# EAGLE design ESP8266 (EAGLE 7.0.0)
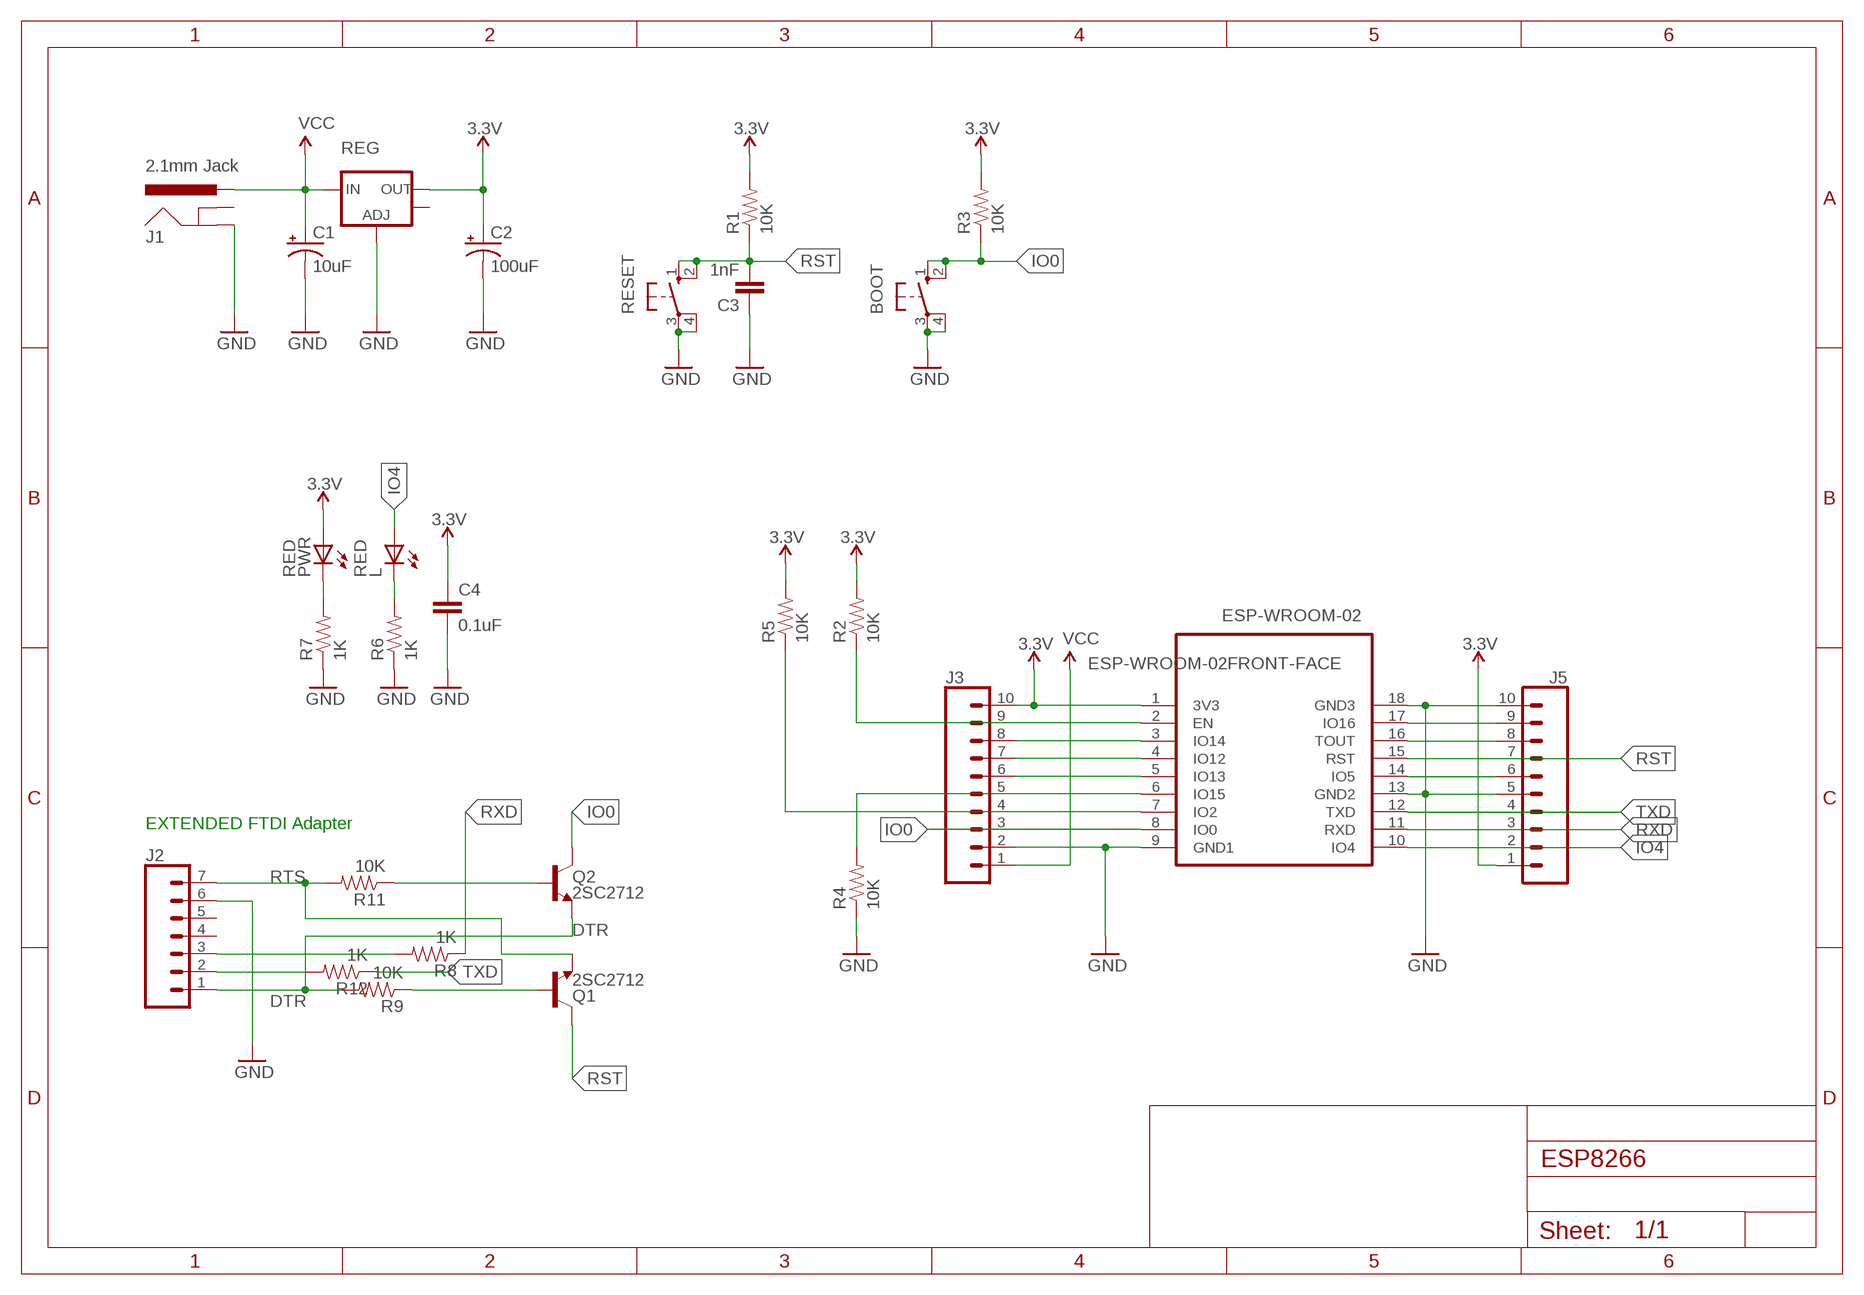
[diagram p0: schematic, sheet 1]

## Parts
BOOT  10-XX  [B3F-10XX]
C1  10uF  CAP_POLD  [PANASONIC_D]
C2  100uF  CAP_POLD  [PANASONIC_D]
C3  1nF  CAP0805  [0805]
C4  0.1uF  CAP0805  [0805]
ESP-WROOM-02  ESP-WROOM-02FRONT-FACE  [FRONT-FACE]
J1  2.1mm Jack  POWER_JACKPTH_LOCK  [POWER_JACK_PTH_LOCK]
J2  CONN_07LOCK  [1X07_LOCK]
J3  CONN_10"  [1X10]
J5  CONN_10"  [1X10]
L  RED  LEDCHIP-LED0805  [CHIP-LED0805]
PWR  RED  LEDCHIP-LED0805  [CHIP-LED0805]
Q1  2SC2712  TRANS_NPN-MMBTA42  [SOT23-3]
Q2  2SC2712  TRANS_NPN-MMBTA42  [SOT23-3]
R1  10K  RESISTOR0805-RES  [0805]
R2  10K  RESISTOR0805-RES  [0805]
R3  10K  RESISTOR0805-RES  [0805]
R4  10K  RESISTOR0805-RES  [0805]
R5  10K  RESISTOR0805-RES  [0805]
R6  1K  RESISTOR0805-RES  [0805]
R7  1K  RESISTOR0805-RES  [0805]
R8  1K  RESISTOR0805-RES  [0805]
R9  10K  RESISTOR0805-RES  [0805]
R11  10K  RESISTOR0805-RES  [0805]
R12  1K  RESISTOR0805-RES  [0805]
REG  V_REG_LM1117SOT223  [SOT223]
RESET  10-XX  [B3F-10XX]

## Nets
3.3V [PWR]: C2.+ C4.1 ESP-WROOM-02.1(3V3) J3.10 J5.1 PWR.A R1.2 R2.2 R3.2 R5.2 REG.2(OUT)
B: Q2.1(B) R11.1
DTR: J2.1 Q2.2(E) R9.2
EN: ESP-WROOM-02.2(EN) J3.9 R2.1
GND [PWR]: BOOT.3(P) BOOT.4(P1) C1.- C2.- C3.1 C4.2 ESP-WROOM-02.9(GND1) ESP-WROOM-02.13(GND2) ESP-WROOM-02.18(GND3) J1.GND J2.6 J3.2 J5.5 J5.10 R4.1 R6.1 R7.1 REG.1(ADJ) RESET.3(P) RESET.4(P1)
IO0: BOOT.1(S) BOOT.2(S1) ESP-WROOM-02.8(IO0) J3.3 Q2.3(C) R3.1
IO4: ESP-WROOM-02.10(IO4) J5.2 L.A
N$1: J2.2 R12.2
N$2: J2.3 R8.2
N$3: Q1.1(B) R9.1
N$6: ESP-WROOM-02.3(IO14) J3.8
N$7: ESP-WROOM-02.4(IO12) J3.7
N$8: ESP-WROOM-02.5(IO13) J3.6
N$9: ESP-WROOM-02.6(IO15) J3.5 R4.2
N$10: ESP-WROOM-02.7(IO2) J3.4 R5.1
N$11 [PWR]: PWR.C R7.2
N$12 [PWR]: L.C R6.2
N$16: ESP-WROOM-02.17(IO16) J5.9
N$17: ESP-WROOM-02.16(TOUT) J5.8
N$19: ESP-WROOM-02.14(IO5) J5.6
RST: C3.2 ESP-WROOM-02.15(RST) J5.7 Q1.3(C) R1.1 RESET.1(S) RESET.2(S1)
RTS: J2.7 Q1.2(E) R11.2
RXD: ESP-WROOM-02.11(RXD) J5.3 R8.1
TXD: ESP-WROOM-02.12(TXD) J5.4 R12.1
VCC [PWR]: C1.+ J1.PWR J3.1 REG.3(IN)
Unconnected: J1.GNDBREAK J2.4 J2.5 REG.4(OUT)

## Notes on the sheet
- EXTENDED FTDI Adapter

## Library data of the parts
BOOT RESET = ginger:10-XX: OMRON SWITCH
C1 C2 = SparkFun:CAP_POL: Capacitor Polarized These are standard SMD and PTH capacitors. Normally 10uF, 47uF, and 100uF in electrolytic and tantalum varieties. Always verify the external diameter of the through hole cap, it varies with capacity, voltage, and manufacturer. The EIA devices should be standard.
C3 C4 = SparkFun:CAP: Capacitor Standard 0603 ceramic capacitor, and 0.1" leaded capacitor.
ESP-WROOM-02 = esp-wroom-02:ESP-WROOM-02: WiFi module - ESP-WROOM-02
J1 = SparkFun-Connectors:POWER_JACK: Power Jack This is the standard 5.5mm barrel jack for power. The PTH is the most common, proven, reliable, footprint. The Slot footprint only works if the mill layer is transmitted to the PCB fab house so be warned. Spark Fun Electronics SKU : PRT-00119 SMT: CONN-08106 Mating wall wart : TOL-00298 (and others)
J2 = SparkFun-Connectors:CONN_07: Multi connection point. Often used as Generic Header-pin footprint for 0.1 inch spaced/style header connections On any of the 0.1 inch spaced packages, you can populate with these: Break Away Headers - Straight <https://www.sparkfun.com/products/116> (PRT-00116) Break Away Male Headers - Right Angle <https://www.sparkfun.com/products/553> (PRT-00553) Female Headers <https://www.sparkfun.com/products/115> (PRT-00115) Break Away Headers - Machine Pin <https://www.sparkfun.com/products/117> (PRT-00117) Break Away Female Headers - Swiss Machine Pin <https://www.sparkfun.com/products/743> (PRT-00743) For SCREWTERMINALS and SPRING TERMINALS visit here: Screw Terimnals on SparkFun.com <https://www.sparkfun.com/search/results?term=Screw+Terminals> (5mm/3.5mm/2.54mm spacing) This device is also useful as a general connection point to wire up your design to another part of your project. Our various solder wires solder well into these plated through hole pads. Hook-Up Wire - Assortment (Stranded, 22 AWG) <https://www.sparkfun.com/products/11375> (PRT-11375) Hook-Up Wire - Assortment (Solid Core, 22 AWG) <https://www.sparkfun.com/products/11367> (PRT-11367) View the entire wire category on our website here <https://www.sparkfun.com/categories/141> Special notes: Molex polarized connector foot print use with SKU : PRT-08231 with associated crimp pins and housings. 1MM SMD Version SKU: PRT-10208 NOTES ON THE VARIANTS LOCK and LOCK_LONGPADS... This footprint was designed to help hold the alignment of a through-hole component (i.e. 6-pin header) while soldering it into place. You may notice that each hole has been shifted either up or down by 0.005 of an inch from it's more standard position (which is a perfectly straight line). This slight alteration caused the pins (the squares in the middle) to touch the edges of the holes. Because they are alternating, it causes a "brace" to hold the component in place. 0.005 has proven to be the perfect amount of "off-center" position when using our standard breakaway headers. Although looks a little odd when you look at the bare footprint, once you have a header in there, the alteration is very hard to notice. Also,if you push a header all the way into place, it is covered up entirely on the bottom side.
J3 J5 = SparkFun-Connectors:CONN_10: Multi connection point. Often used as Generic Header-pin footprint for 0.1 inch spaced/style header connections On any of the 0.1 inch spaced packages, you can populate with these: Break Away Headers - Straight <https://www.sparkfun.com/products/116> (PRT-00116) Break Away Male Headers - Right Angle <https://www.sparkfun.com/products/553> (PRT-00553) Female Headers <https://www.sparkfun.com/products/115> (PRT-00115) Break Away Headers - Machine Pin <https://www.sparkfun.com/products/117> (PRT-00117) Break Away Female Headers - Swiss Machine Pin <https://www.sparkfun.com/products/743> (PRT-00743) Arduino Stackable Header - 10 Pin <https://www.sparkfun.com/products/11376> (PRT-11376) For SCREWTERMINALS and SPRING TERMINALS visit here: Screw Terimnals on SparkFun.com <https://www.sparkfun.com/search/results?term=Screw+Terminals> (5mm/3.5mm/2.54mm spacing) This device is also useful as a general connection point to wire up your design to another part of your project. Our various solder wires solder well into these plated through hole pads. Hook-Up Wire - Assortment (Stranded, 22 AWG) <https://www.sparkfun.com/products/11375> (PRT-11375) Hook-Up Wire - Assortment (Solid Core, 22 AWG) <https://www.sparkfun.com/products/11367> (PRT-11367) View the entire wire category on our website here <https://www.sparkfun.com/categories/141> Special notes: Molex polarized connector foot print use with SKU : PRT-08231 with associated crimp pins and housings. 1MM SMD Version SKU: PRT-10208 NOTES ON THE VARIANTS LOCK and LOCK_LONGPADS... This footprint was designed to help hold the alignment of a through-hole component (i.e. 6-pin header) while soldering it into place. You may notice that each hole has been shifted either up or down by 0.005 of an inch from it's more standard position (which is a perfectly straight line). This slight alteration caused the pins (the squares in the middle) to touch the edges of the holes. Because they are alternating, it causes a "brace" to hold the component in place. 0.005 has proven to be the perfect amount of "off-center" position when using our standard breakaway headers. Although looks a little odd when you look at the bare footprint, once you have a header in there, the alteration is very hard to notice. Also,if you push a header all the way into place, it is covered up entirely on the bottom side.; PROD_ID: CONN-11563
L PWR = adafruit:LED: LED OSRAM: - CHIPLED LG R971, LG N971, LY N971, LG Q971, LY Q971, LO R971, LY R971 LH N974, LH R974 LS Q976, LO Q976, LY Q976 LO Q996 - Hyper CHIPLED LW Q18S LB Q993, LB Q99A, LB R99A - SideLED LS A670, LO A670, LY A670, LG A670, LP A670 LB A673, LV A673, LT A673, LW A673 LH A674 LY A675 LS A676, LA A676, LO A676, LY A676, LW A676 LS A679, LY A679, LG A679 - Hyper Micro SIDELED® LS Y876, LA Y876, LO Y876, LY Y876 LT Y87S - SmartLED LW L88C, LW L88S LB L89C, LB L89S, LG L890 LS L89K, LO L89K, LY L89K LS L896, LA L896, LO L896, LY L896 - TOPLED LS T670, LO T670, LY T670, LG T670, LP T670 LSG T670, LSP T670, LSY T670, LOP T670, LYG T670 LG T671, LOG T671, LSG T671 LB T673, LV T673, LT T673, LW T673 LH T674 LS T676, LA T676, LO T676, LY T676, LB T676, LH T676, LSB T676, LW T676 LB T67C, LV T67C, LT T67C, LS T67K, LO T67K, LY T67K, LW E67C LS E67B, LA E67B, LO E67B, LY E67B, LB E67C, LV E67C, LT E67C LW T67C LS T679, LY T679, LG T679 LS T770, LO T770, LY T770, LG T770, LP T770 LB T773, LV T773, LT T773, LW T773 LH T774 LS E675, LA E675, LY E675, LS T675 LS T776, LA T776, LO T776, LY T776, LB T776 LHGB T686 LT T68C, LB T68C - Hyper Mini TOPLED® LB M676 - Mini TOPLED Santana® LG M470 LS M47K, LO M47K, LY M47K Source: http://www.osram.convergy.de/
Q1 Q2 = SparkFun-DiscreteSemi:TRANS_NPN: NPN transistor Current controlled devices typically used to amplify current or used as a switch. BC547 - COM-08928 <http://www.sparkfun.com/products/8928> (TO-92 45V 100mA) (1.Collector 2.Base 3.Emitter) 2N3904 - COM-00521 <http://www.sparkfun.com/products/521> (TO-92 40V 200mA) (1.Emitter 2.Base 3.Collector) P2N2222A - COM-12852 <http://www.sparkfun.com/products/12852> (TO-92 40V 600mA) (1.Collector 2.Base 3.Emitter); PROD_ID: TRANS-09116; VALUE: 500mA/300V
R1-R9 R11 R12 = SparkFun:RESISTOR: Resistor Basic schematic elements and footprints for 0603, 1206, and PTH resistors.
REG = SparkFun-PowerIC:V_REG_LM1117: Voltage Regulator LM1117 Standard adjustable voltage regulator but in SMD form. Spark Fun Electronics SKU : COM-00595

## Net classes
0 default: width 0.254 mm
1 PWR: width 0.762 mm

## Board
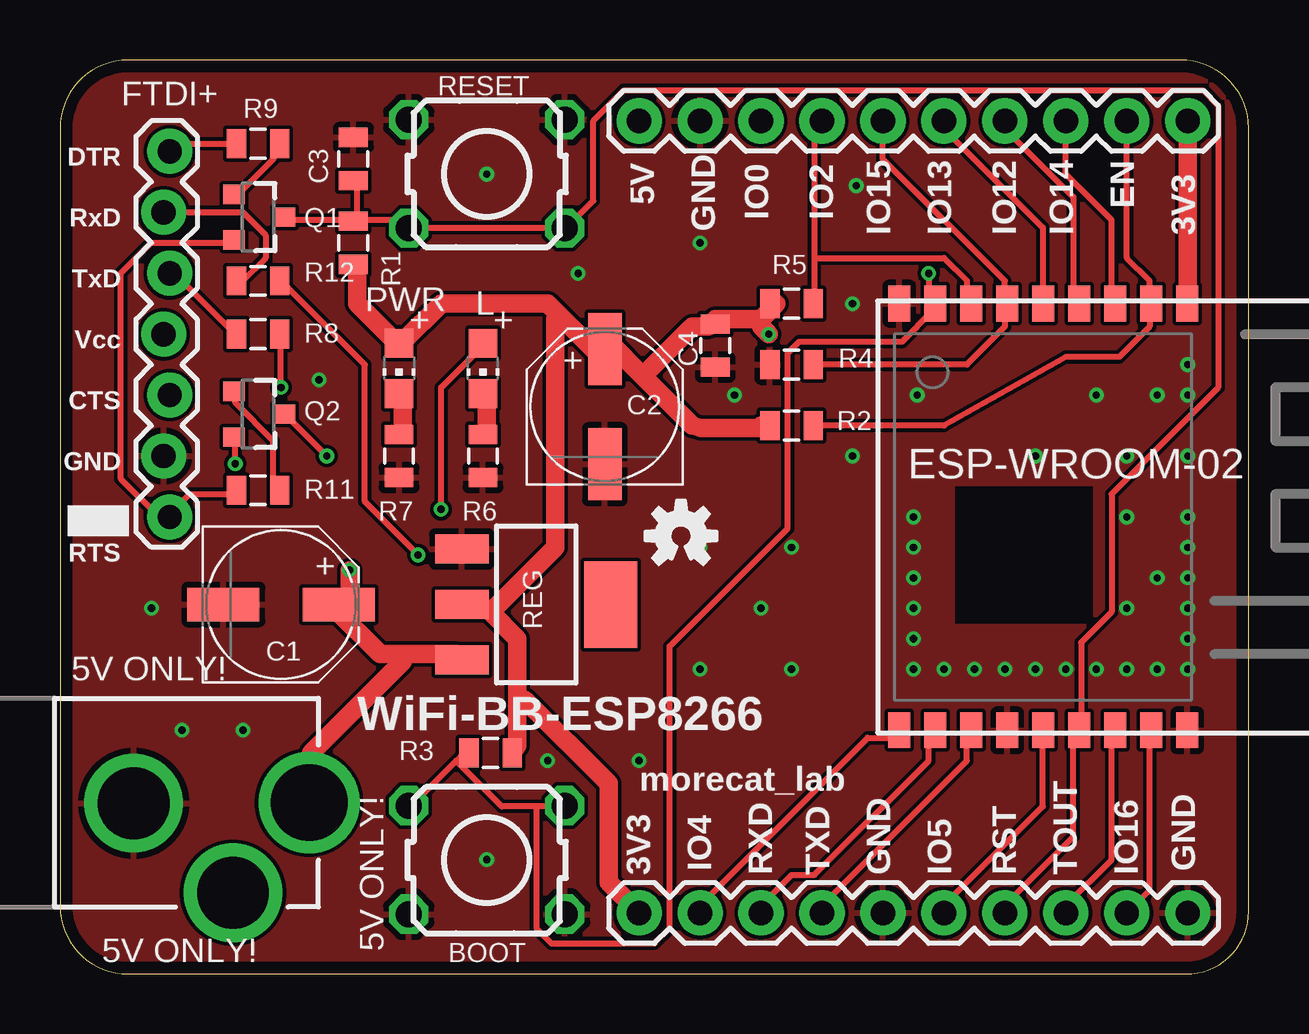
[diagram p1: board, top side]
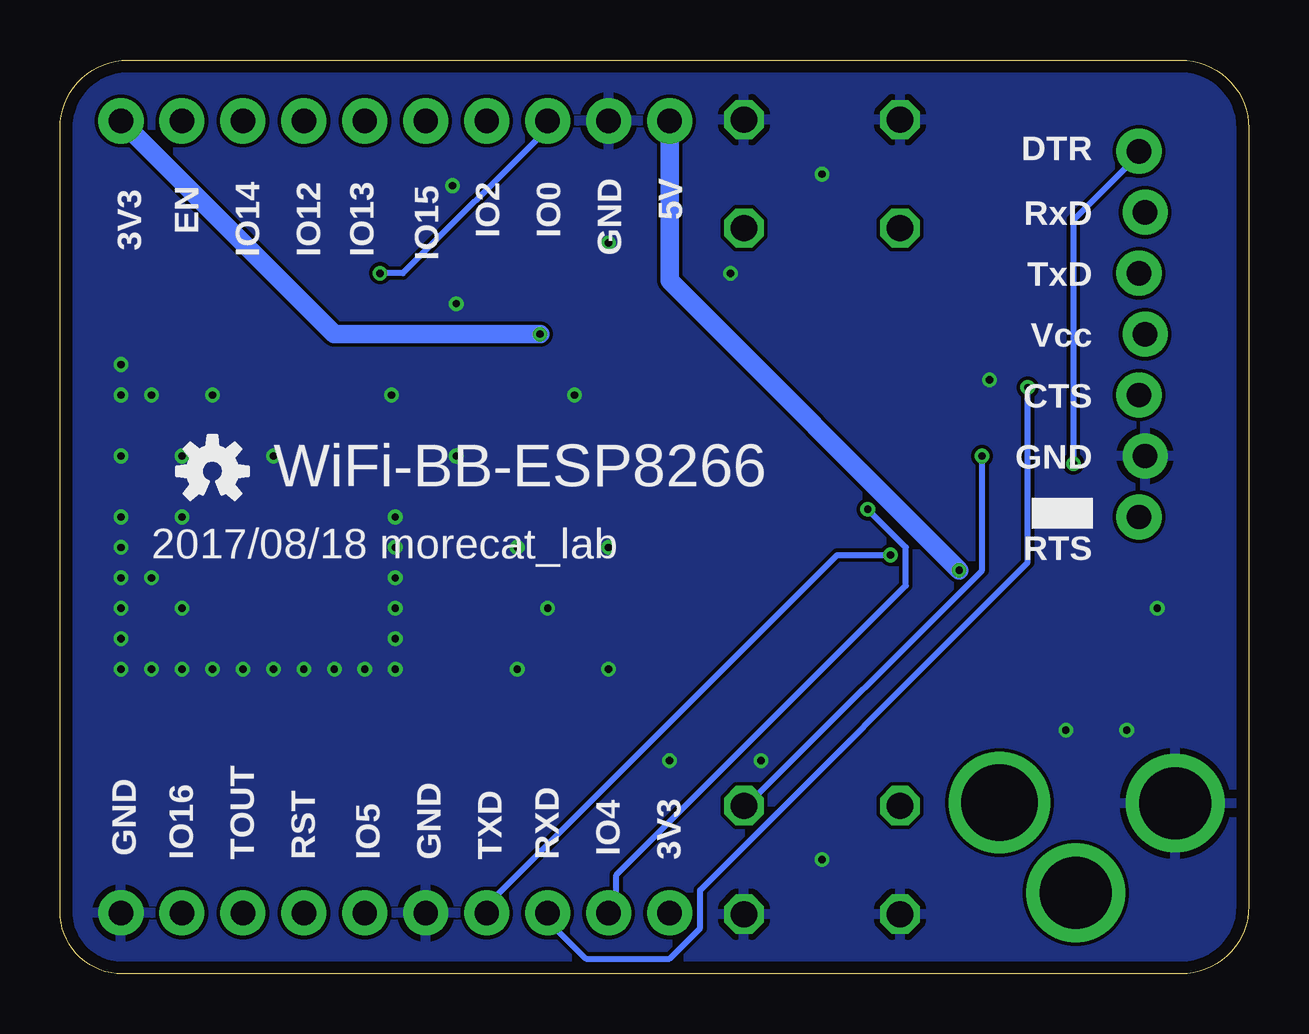
[diagram p2: board, bottom side, seen from below]

Size 49.53 x 38.1 mm. Coordinates in mm from the lower left corner, seen from the top.
Outline: 49.53,2.6 49.53,35.26 arc90 46.69,38.1 2.84,38.1 arc90 0,35.26 0,2.83 arc90 2.83,0 46.93,0 arc90 49.53,2.6
Copper layers (1*2*15*16): Top 0.035mm / dielectric 0.2mm / layer 2 0.035mm / dielectric 1.2mm / layer 15 0.035mm / dielectric 0.2mm / Bottom 0.035mm
Design rules "Elecrow_PCB_eagle_rule": minimum track width 6mil, minimum drill 12mil, track to track 6mil, track to pad 8mil, pad to pad 12mil, via to via 6mil, smd to smd 0mil, copper to edge 20mil, drill to drill 10mil, minimum pad ring 6mil, minimum via ring 6mil, stop-mask expansion 0mil, vias tented up to drill 100mil, thermal gap 10mil

### Footprints (pad centres in the part's own frame; a part is rotated, then mirrored left to right if it is on the bottom)
B3F-10XX = drill 1.092 octagon: 1 -3.251,2.261; 2 3.251,2.261; 3 -3.251,-2.261; 4 3.251,-2.261
PANASONIC_D = smd 3 x 1.4: + 2.4,0; - -2.4,0
0805 = smd 0.8 x 1.2: 1 -0.9,0; 2 0.9,0
FRONT-FACE = smd 1.485 x 0.9: 1 -8.893,4.9; 2 -8.893,3.4; 3 -8.893,1.9; 4 -8.893,0.4; 5 -8.893,-1.1; 6 -8.893,-2.6; 7 -8.893,-4.1; 8 -8.893,-5.6; 9 -8.893,-7.1; 10 8.893,-7.1; 11 8.893,-5.6; 12 8.893,-4.1; 13 8.893,-2.6; 14 8.893,-1.1; 15 8.893,0.4; 16 8.893,1.9; 17 8.893,3.4; 18 8.893,4.9
POWER_JACK_PTH_LOCK = drill 2.997 pad 4.115: GND 0.025,6.557; GNDBREAK 3.762,10.7 | drill 3.2 pad 4.115: PWR 0,13.878
1X07_LOCK = drill 1.016 pad 1.88: 1 0,0.127; 2 2.54,-0.127; 3 5.08,0.127; 4 7.62,-0.127; 5 10.16,0.127; 6 12.7,-0.127; 7 15.24,0.127
1X10 = drill 1.016 pad 1.88: 1 0,0; 2 2.54,0; 3 5.08,0; 4 7.62,0; 5 10.16,0; 6 12.7,0; 7 15.24,0; 8 17.78,0; 9 20.32,0; 10 22.86,0
CHIP-LED0805 = smd 1.2 x 1.2: A 0,-1.05; C 0,1.05
SOT23-3 = smd 0.8 x 0.9: 1 -0.95,-1; 2 0.95,-1; 3 0,1.1
SOT223 = smd 1.219 x 2.235: 1 -2.311,-3.099; 2 0,-3.099; 3 2.311,-3.099 | smd 3.6 x 2.2: 4 0,3.099

### Placement (x,y rotation side)
BOOT  17.78,4.75 0 top
C1  9.21,15.4 0 top
C2  22.7,23.65 90 top
C3  12.22,33.97 270 top
C4  27.3,26.19 270 top
ESP-WROOM-02  42.07,19.05 270 top
J1  -3.49,7.14 270 top
J2  4.45,34.29 270 top
J3  24.13,35.56 0 top
J5  24.13,2.54 0 top
L  17.62,25.24 180 top
PWR  14.13,25.24 180 top
Q1  8.26,31.55 270 top
Q2  8.26,23.34 270 top
R1  12.22,30.48 270 top
R2  30.48,22.86 180 top
R3  17.94,9.22 0 top
R4  30.48,25.4 0 top
R5  30.48,27.94 180 top
R6  17.62,21.59 90 top
R7  14.13,21.59 90 top
R8  8.26,26.67 180 top
R9  8.26,34.61 180 top
R11  8.26,20.16 180 top
R12  8.26,28.89 180 top
REG  19.84,15.4 270 top
RESET  17.78,33.35 180 top
U$2  [OSHW-LOGO-S]  25.88,18.26 0 top
U$3  [OSHW-LOGO-S]  43.18,20.95 0 bottom

### Tracks (layer width: path | path; a pad name or v marks a point on that pad's centre or on a via)
3.3V  (via drill 0.3)
  Top 0.762: 19.05,11.43 19.05,13.97 17.94,15.08 | 19.05,11.43 19.05,9.53 R3.2 | 17.94,15.08 17.78,15.24 16.83,15.24 REG.2 | J5.1 22.86,3.81 22.86,7.94 19.37,11.43 19.05,11.43 | J3.10 46.99,28.26 ESP-WROOM-02.1 | R1.2 12.38,29.53 12.38,27.94 13.97,26.35 PWR.A 14.29,26.35 15.88,27.94 20.32,27.94 20.8,27.46 | 29.21,27.3 27.3,27.3 C4.1 26.99,26.99 26.35,26.99 24.29,24.92 | 29.21,27.3 29.84,27.94 R5.2 | 29.53,22.86 29.53,22.76 | 29.53,22.76 29.21,22.86 R2.2 | 24.29,24.92 22.86,26.35 C2.+ 22.54,25.72 20.8,27.46 | 24.29,24.92 26.35,22.86 26.72,22.76 29.53,22.76 | v29.53,26.67 29.21,26.99 29.21,27.3 | 17.94,15.08 20.64,17.78 20.64,27.3 20.8,27.46
  Bottom 0.762: J3.10 38.1,26.67 v29.53,26.67
B
  Top 0.254: Q2.1 7.3,24.13 7.3,23.81 8.89,22.23 8.89,20.32 R11.1
DTR  (via drill 0.3)
  Top 0.254: v7.3,21.27 7.3,22.23 Q2.2 | R9.2 5.08,34.61 4.76,34.29 J2.1
  Bottom 0.254: v7.3,21.27 7.3,31.43 4.45,34.29 J2.1
EN
  Top 0.254: R2.1 36.83,22.86 41.91,25.72 44.13,25.72 45.4,26.99 45.4,27.94 ESP-WROOM-02.2 45.4,28.26 45.4,28.89 44.45,29.84 J3.9
GND  (via drill 0.3)
  other vias: 45.72,12.7 45.72,16.51 39.37,12.7 46.99,24.13 46.99,19.05 43.18,24.13 35.56,12.7 35.56,16.51 46.99,12.7 43.18,12.7 41.91,12.7 36.83,12.7 44.45,12.7 38.1,12.7 40.64,12.7 35.56,15.24 35.56,17.78 35.56,13.97 35.56,19.05 45.72,24.13 46.99,25.4 46.99,13.97 46.99,16.51 46.99,15.24 46.99,17.78 46.99,21.59 44.45,21.59 44.45,19.05 44.45,15.24 40.64,21.59 29.21,15.24 30.48,17.78 3.81,15.24 7.62,10.16 5.08,10.16 30.48,12.7 26.67,12.7 26.67,17.78 24.13,8.89 20.32,8.89 10.79,24.77 17.78,4.76 17.78,33.34 26.67,30.48 35.72,24.13 28.1,24.13 21.59,29.21 33.02,21.59 33.18,32.86 33.02,27.94
  pour Bottom: 0,40.64 0,0 50.8,0 50.8,40.64
  pour Top: 0,0 50.8,0 50.8,40.64 0,40.64
IO0  (via drill 0.3)
  Top 0.254: 16.51,8.89 14.61,6.99 BOOT.1 | 16.51,8.89 16.83,9.21 R3.1 | v11.11,21.59 9.53,23.18 Q2.3 | 16.51,8.89 18.41,6.99 19.84,6.99 | 19.84,6.99 20.95,6.99 BOOT.2 | v36.2,29.21 36.2,28.26 ESP-WROOM-02.8 36.35,27.94 36.35,27.62 35.08,26.35 30.8,26.35 30.32,25.88 30.32,18.57 25.4,13.65 25.4,1.91 24.77,1.27 20.48,1.27 19.84,1.91 19.84,6.99
  Bottom 0.254: v11.11,21.59 11.11,16.83 20.95,6.99 BOOT.2 | v36.2,29.21 35.24,29.21 29.21,35.24 J3.3
IO4  (via drill 0.3)
  Top 0.254: v15.88,19.37 15.88,24.45 17.46,26.04 L.A | J5.2 26.67,2.86 33.66,9.84 34.92,9.84 ESP-WROOM-02.10
  Bottom 0.254: v15.88,19.37 14.29,17.78 14.29,16.19 26.35,4.13 26.35,2.86 J5.2
N$1
  Top 0.254: J2.2 7.62,31.75 8.57,30.8 8.57,29.84 7.62,28.89 R12.2
N$2
  Top 0.254: R8.2 7.3,26.67 4.76,29.21 J2.3
N$3
  Top 0.254: Q1.1 7.3,32.7 7.62,32.7 8.89,33.97 8.89,34.61 R9.1
N$6
  Top 0.254: J3.8 41.91,33.34 43.81,31.43 43.81,28.26 ESP-WROOM-02.3
N$7
  Top 0.254: J3.7 39.37,35.24 42.23,32.38 42.23,28.26 ESP-WROOM-02.4
N$8
  Top 0.254: J3.6 36.83,35.24 40.96,31.11 40.96,28.26 ESP-WROOM-02.5
N$9
  Top 0.254: R4.2 37.78,25.4 39.37,26.99 39.37,27.94 ESP-WROOM-02.6 39.37,28.26 39.37,28.89 34.29,33.97 J3.5
N$10
  Top 0.254: 31.43,29.84 31.43,35.24 J3.4 | 31.43,29.84 31.43,27.94 R5.1 | 31.43,29.84 36.83,29.84 37.78,28.89 37.78,28.26 ESP-WROOM-02.7
N$11
  Top 0.762: R7.2 14.29,22.54 14.29,24.13 PWR.C
N$12
  Top 0.762: R6.2 17.78,22.54 17.78,24.13 L.C
N$16
  Top 0.254: J5.9 45.4,3.49 45.4,9.84 ESP-WROOM-02.17
N$17
  Top 0.254: J5.8 41.91,2.86 43.81,4.76 43.81,9.84 ESP-WROOM-02.16
N$19
  Top 0.254: J5.6 36.83,2.86 40.96,6.99 40.96,9.84 ESP-WROOM-02.14
RST
  Top 0.254: Q1.3 9.53,31.43 12.06,31.43 R1.1 12.38,31.43 | 12.38,31.43 12.38,33.02 C3.2 | 12.38,31.43 13.97,31.43 14.29,31.11 RESET.2 14.61,31.11 20.95,31.11 RESET.1 21.11,31.11 22.23,32.23 22.23,35.56 23.5,36.83 47.62,36.83 48.26,36.2 48.26,24.45 43.81,20 43.81,15.08 42.55,13.81 42.55,10.16 ESP-WROOM-02.15 42.23,9.84 42.23,5.71 39.37,2.86 J5.7
RTS
  Top 0.254: 4.45,19.05 4.13,19.05 2.54,20.64 2.54,29.21 3.81,30.48 6.99,30.48 Q1.2 | 4.45,19.05 5.4,20 7.3,20 R11.2 | 4.45,19.05 J2.7
RXD  (via drill 0.3)
  Top 0.254: v9.21,24.45 9.21,26.67 R8.1 | J5.3 29.21,2.86 30.48,4.13 31.43,4.13 36.2,8.89 36.2,9.84 ESP-WROOM-02.11
  Bottom 0.254: v9.21,24.45 9.21,17.14 22.86,3.49 22.86,1.91 24.13,0.64 27.62,0.64 29.21,2.22 J5.3
TXD  (via drill 0.3)
  Top 0.254: v14.92,17.46 12.7,19.68 12.7,25.4 9.21,28.89 R12.1 | J5.4 31.75,2.86 37.78,8.89 37.78,9.84 ESP-WROOM-02.12
  Bottom 0.254: v14.92,17.46 17.14,17.46 31.75,2.86 J5.4
VCC  (via drill 0.3)
  Top 0.762: 14.29,13.34 13.34,13.34 11.43,15.24 C1.+ 12.06,14.92 v12.06,16.83 | 14.29,13.34 16.51,13.34 REG.3 | J1.PWR 10.48,7.3 10.48,9.21 14.29,13.02 14.29,13.34
  Bottom 0.762: J3.1 24.13,28.89 v12.06,16.83

### Text on the board
tNames: FTDI+ | DTR | RxD | 5V | EN | GND | IO0 | IO2 | IO15 | IO13 | IO12 | IO14 | 3V3 | TxD | Vcc | + | CTS | GND | RTS | + | 5V ONLY! | WiFi-BB-ESP8266 | morecat_lab | 3V3 | IO4 | RXD | TXD | GND | IO5 | RST | TOUT | IO16 | GND | 5V ONLY! | 5V ONLY!
bNames: DTR | 5V | GND | IO0 | IO2 | IO15 | IO13 | IO12 | IO14 | EN | 3V3 | RxD | TxD | Vcc | CTS | GND | WiFi-BB-ESP8266 | RTS | 2017/08/18 morecat_lab | 3V3 | IO4 | RXD | TXD | GND | IO5 | RST | TOUT | IO16 | GND